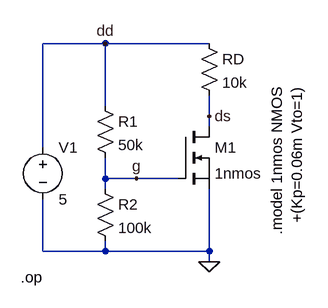
[diagram p0: schematic 12-3-4-a-1.asc]
12-3-4-a-1.asc, the LTspice schematic file:
Version 4
SHEET 1 880 680
WIRE 96 -32 0 -32
WIRE 256 -32 96 -32
WIRE 96 64 96 -32
WIRE 256 80 256 48
WIRE 256 96 256 80
WIRE 0 128 0 -32
WIRE 96 176 96 144
WIRE 144 176 96 176
WIRE 208 176 144 176
WIRE 96 192 96 176
WIRE 0 288 0 208
WIRE 96 288 96 272
WIRE 96 288 0 288
WIRE 256 288 256 192
WIRE 256 288 96 288
WIRE 256 304 256 288
FLAG 256 304 0
FLAG 96 -32 dd
FLAG 144 176 g
FLAG 256 80 ds
SYMBOL res 80 48 R0
SYMATTR InstName R1
SYMATTR Value 50k
SYMBOL res 80 176 R0
SYMATTR InstName R2
SYMATTR Value 100k
SYMBOL res 240 -48 R0
SYMATTR InstName RD
SYMATTR Value 10k
SYMBOL nmos 208 96 R0
SYMATTR InstName M1
SYMATTR Value 1nmos
SYMBOL voltage 0 112 R0
WINDOW 123 0 0 Left 0
WINDOW 39 0 0 Left 0
SYMATTR InstName V1
SYMATTR Value 5
TEXT 360 32 VRight 2 !.model 1nmos NMOS\n+(Kp=0.06m Vto=1)
TEXT -34 328 Left 2 !.op

The netlist it stands for:
* 12-3-4-a-1.asc
R1 dd g 50k
R2 g 0 100k
RD dd ds 10k
M1 ds g 0 0 1nmos
V1 dd 0 5
.model NMOS NMOS
.model PMOS PMOS
.lib standard.mos
.model 1nmos NMOS
+(Kp=0.06m Vto=1)
.op
.backanno
.end